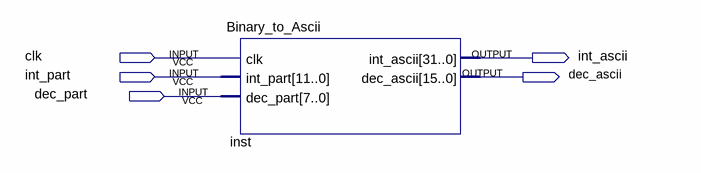
[diagram p0: schematic sheet]
// Quartus schematic Binary_to_Ascii.bdf as structural Verilog: 1 symbols, 5 pins
module Binary_to_Ascii (
  input  clk,
  input  int_part,
  input  dec_part,
  output int_ascii,
  output dec_ascii
);

  Binary_to_Ascii inst (.clk(clk), .int_part({12{int_part}}));  // open: dec_part, int_ascii, dec_ascii
endmodule
